# EasyEDA Pro project CapstoneMCU.epro

# Schematic Schematic1

## Sheets
1 sensors: Board Name: Board1; Create Date: 2026-01-15; Page Name: sensors; Project Name: CapPCB1; Schematic Name: Schematic1; Update Date: 2026-01-14; Page Size: A4; Version: V1.0
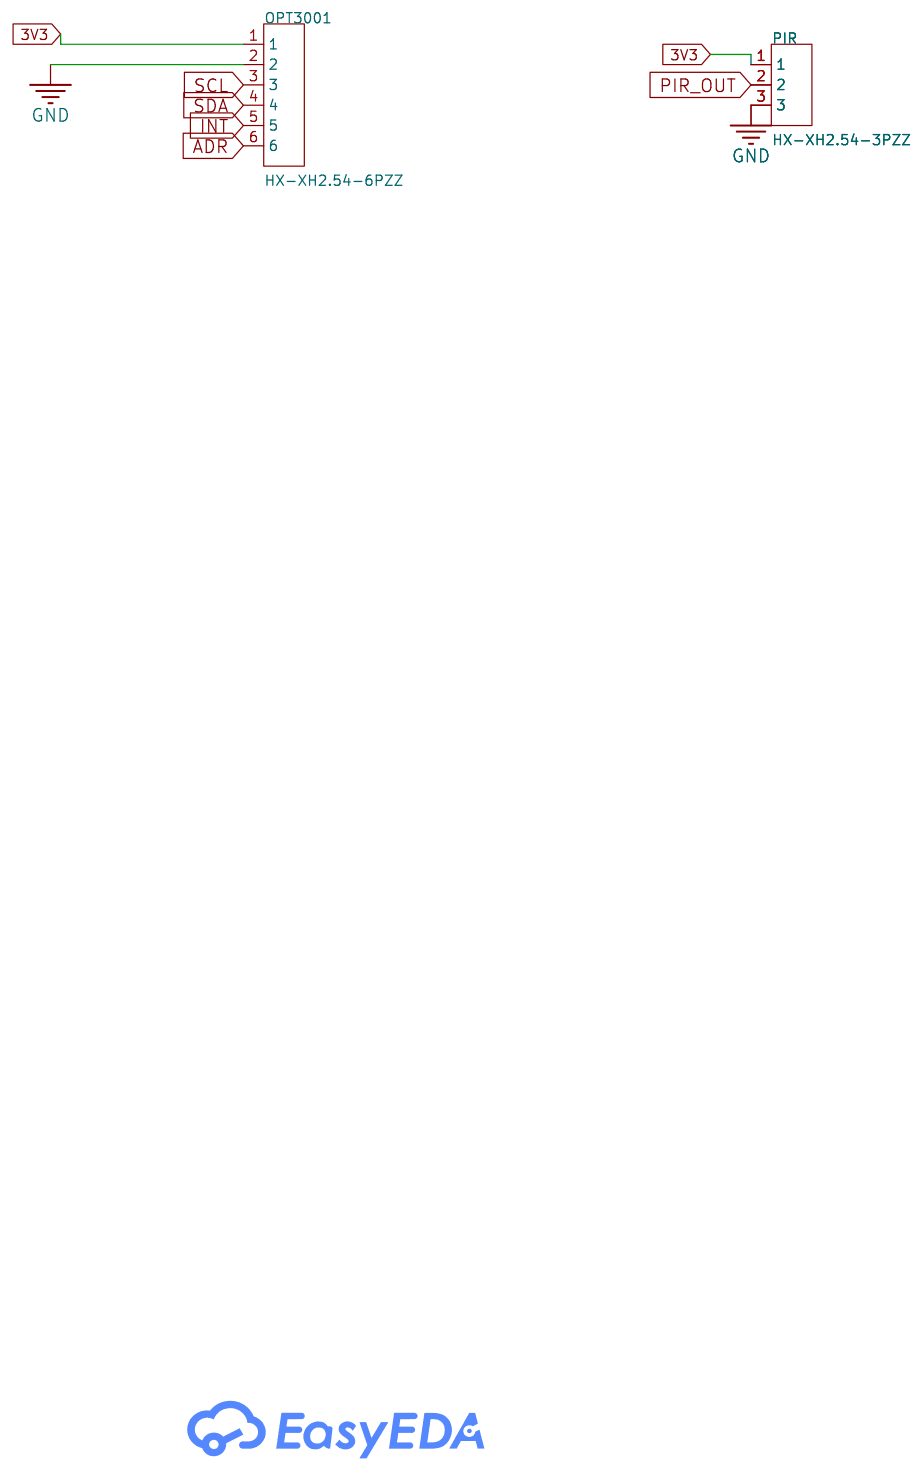
[diagram p0: sensors]
2 ESP32-S3: Page Name: ESP32-S3; Company: EasyEDA.com
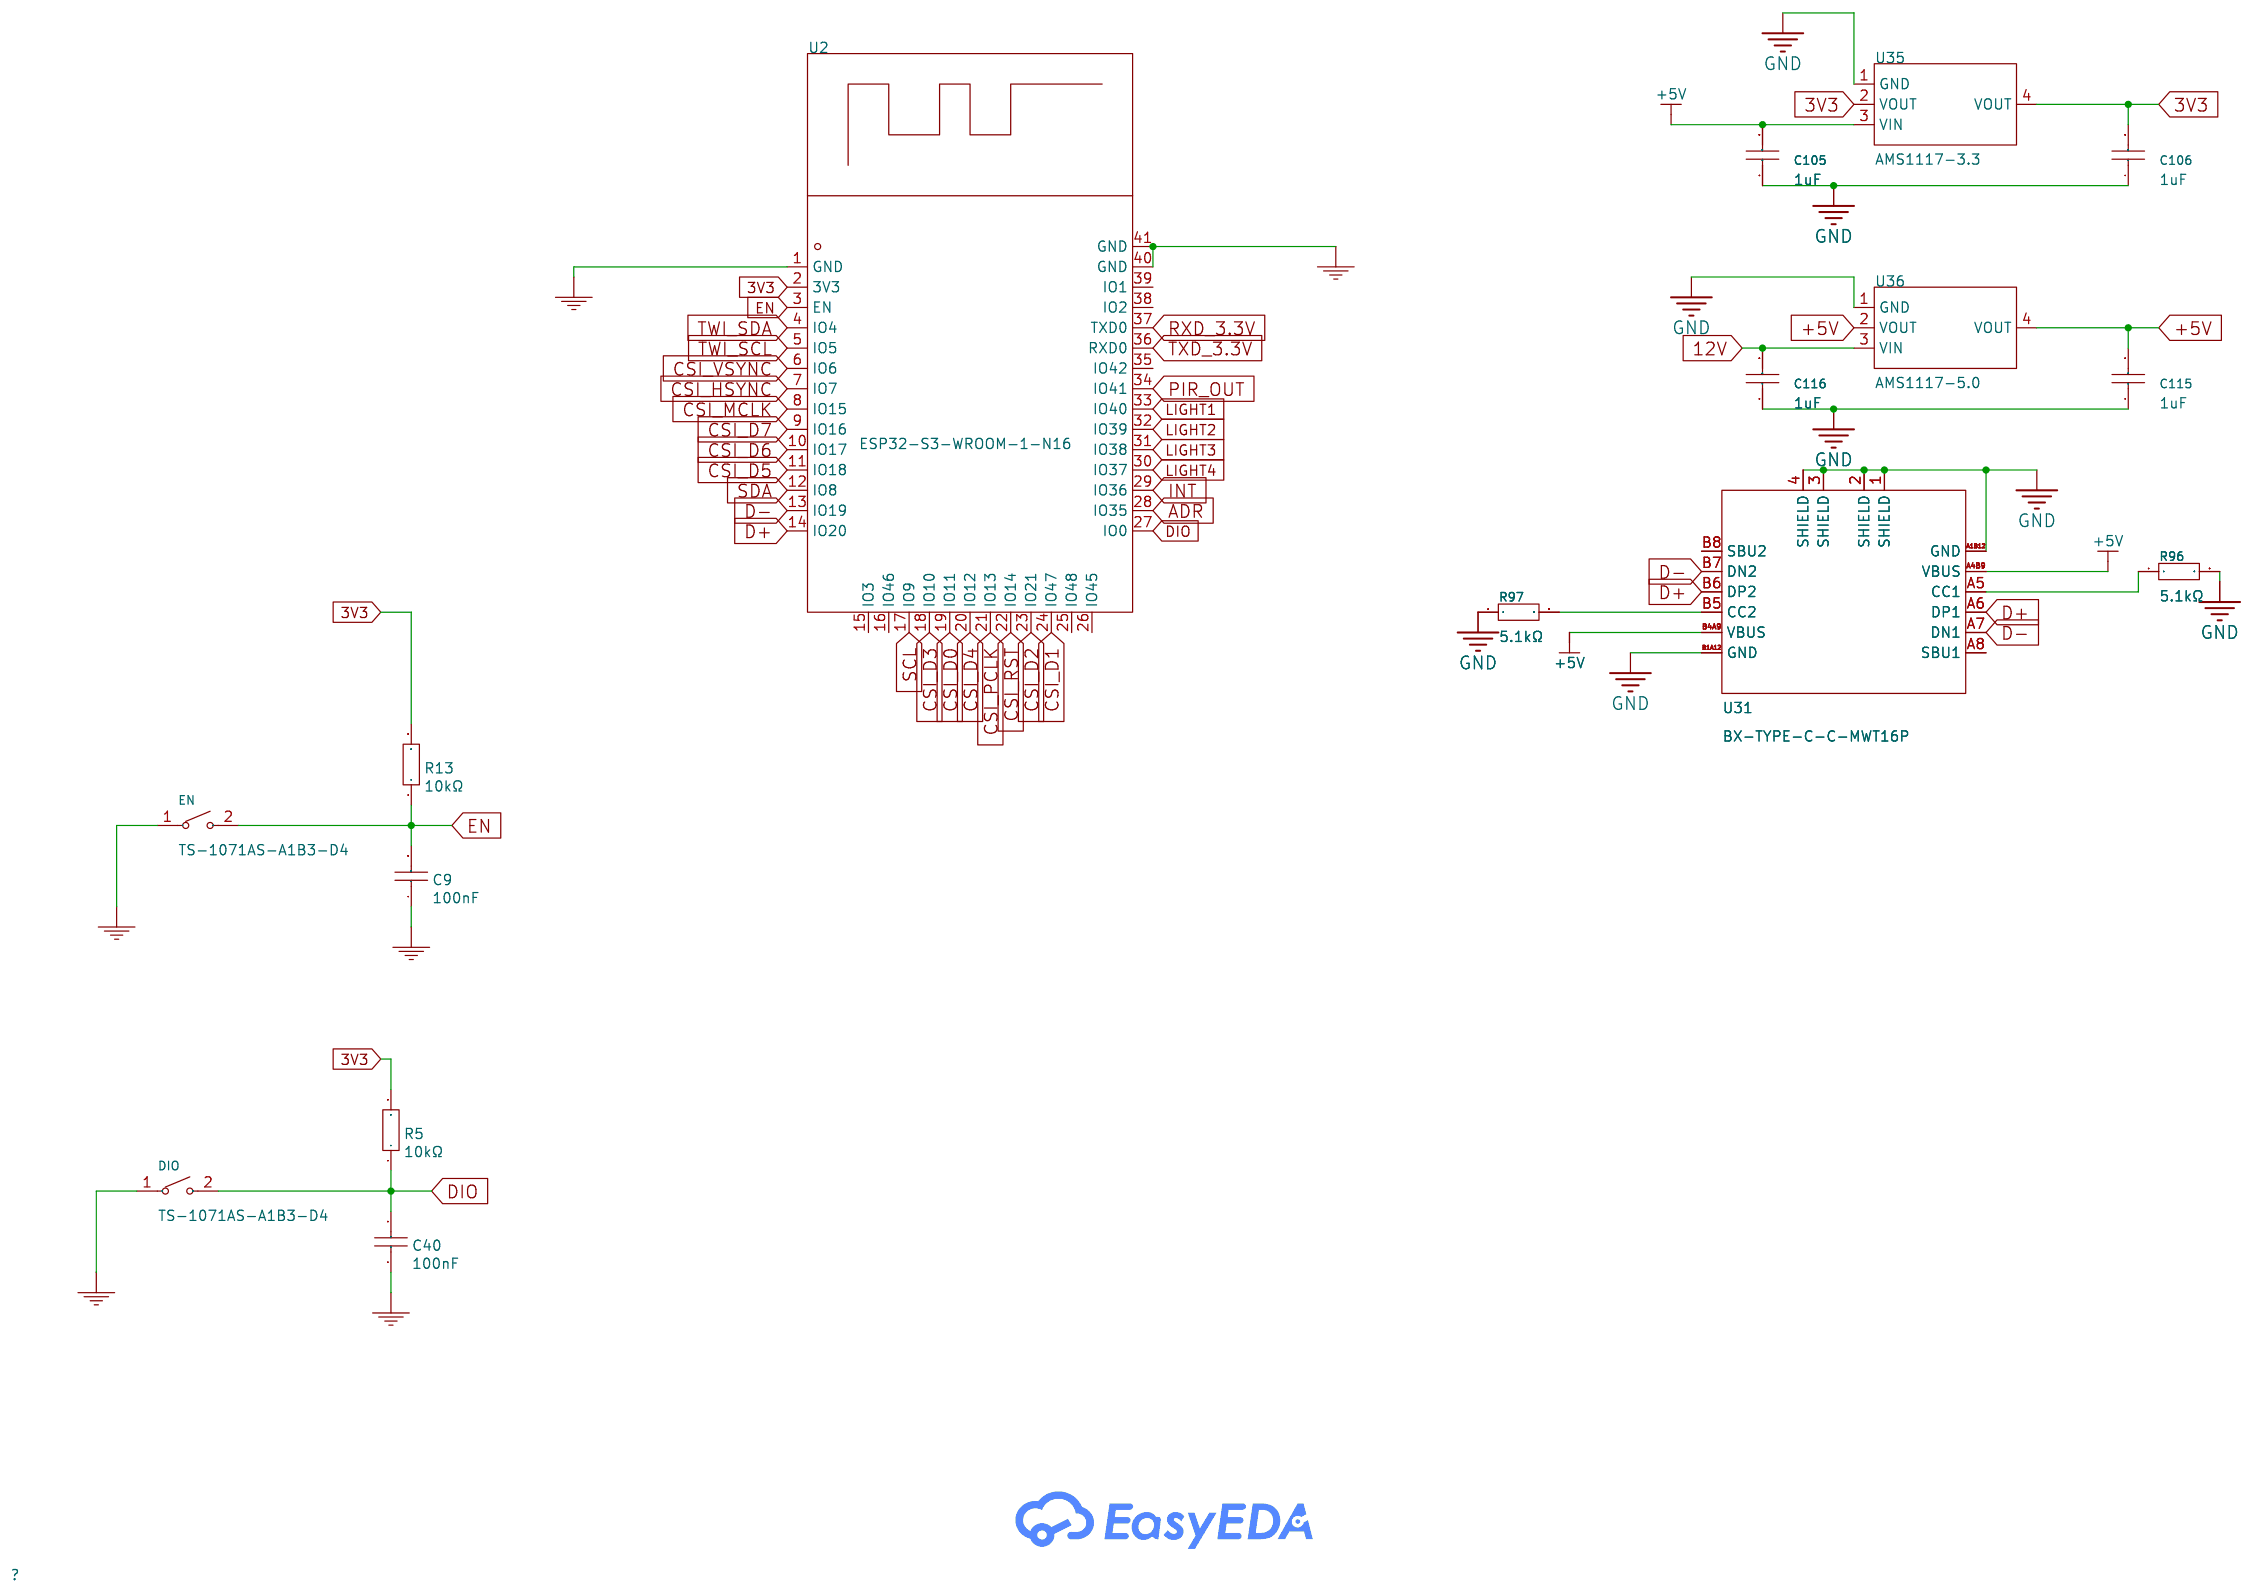
[diagram p1: ESP32-S3]
3 MOSFET: Create Date: 2026-01-14; Page Name: MOSFET; Update Date: 2026-02-08; Company: EasyEDA.com
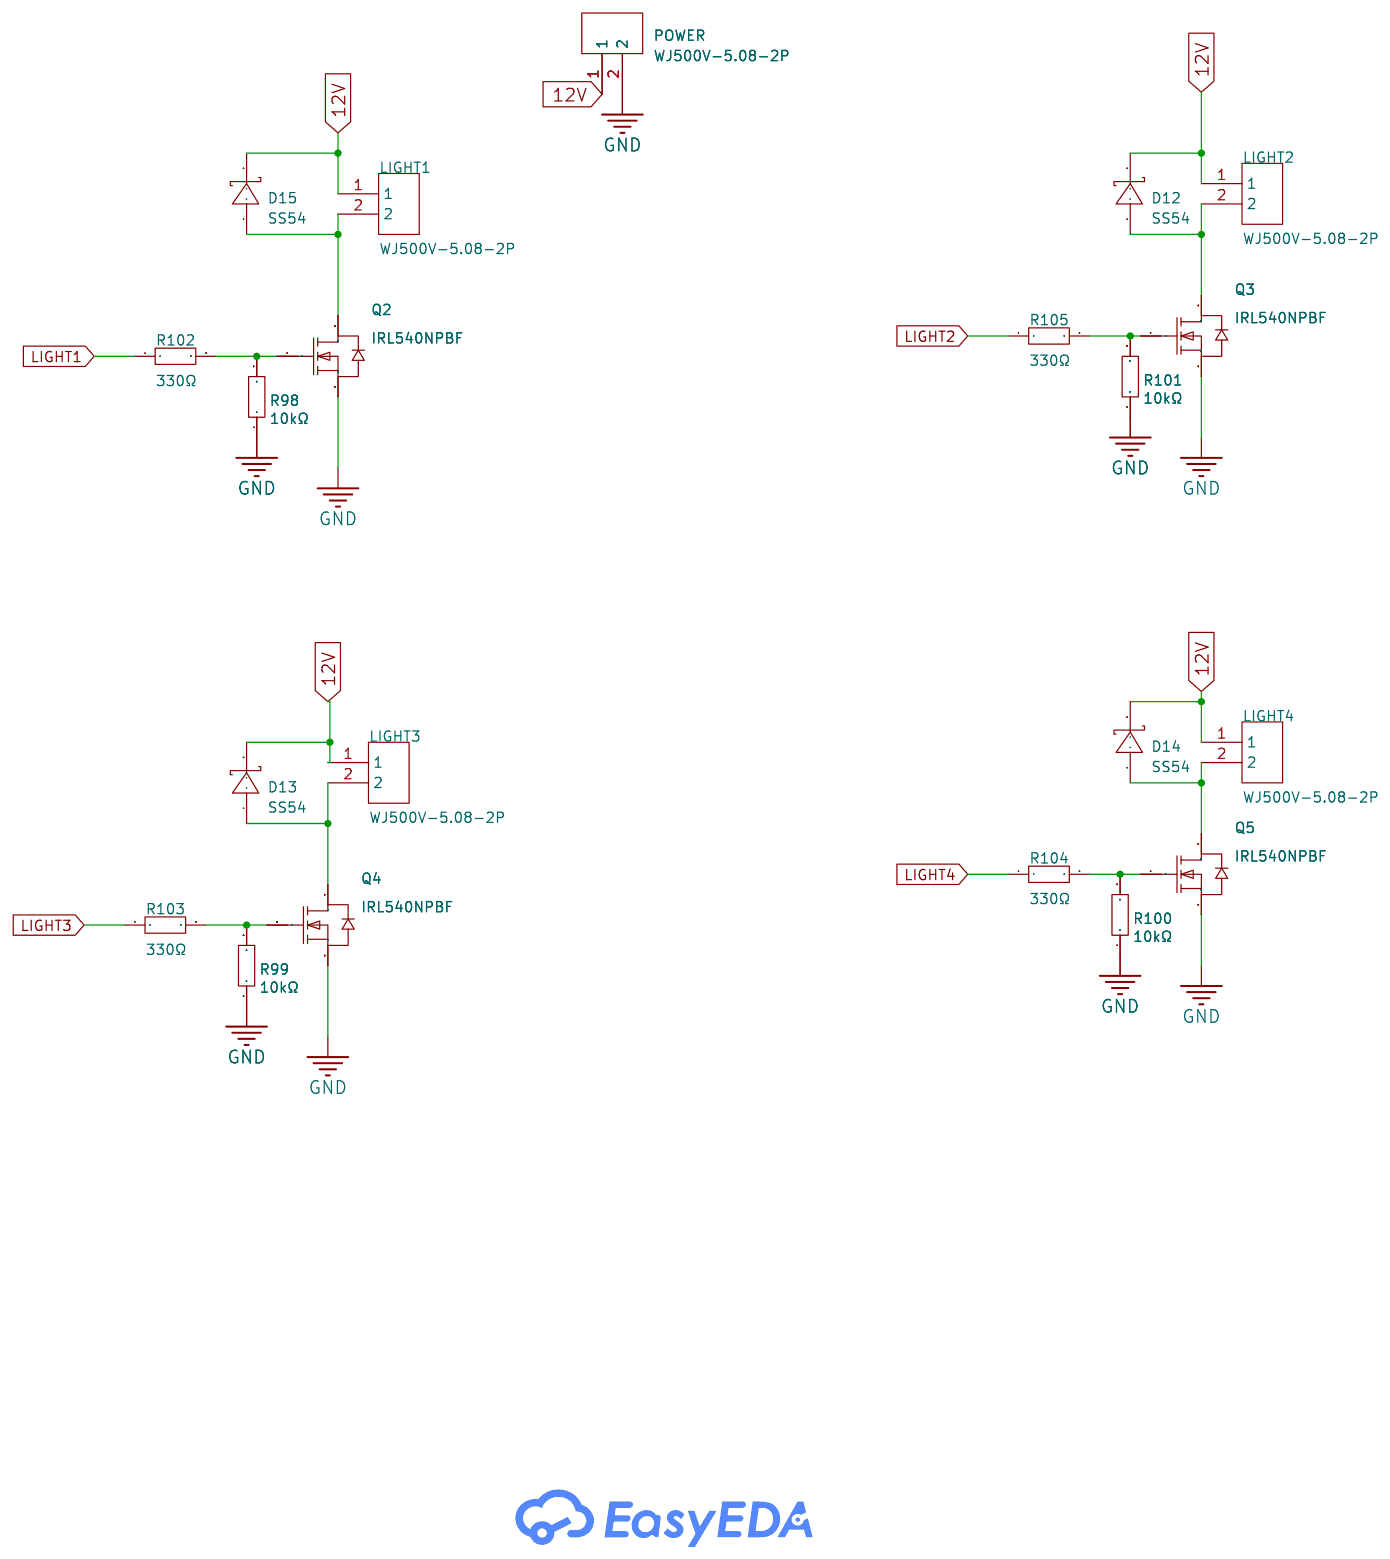
[diagram p2: MOSFET]
4 camera: Page Name: camera; Company: EasyEDA.com
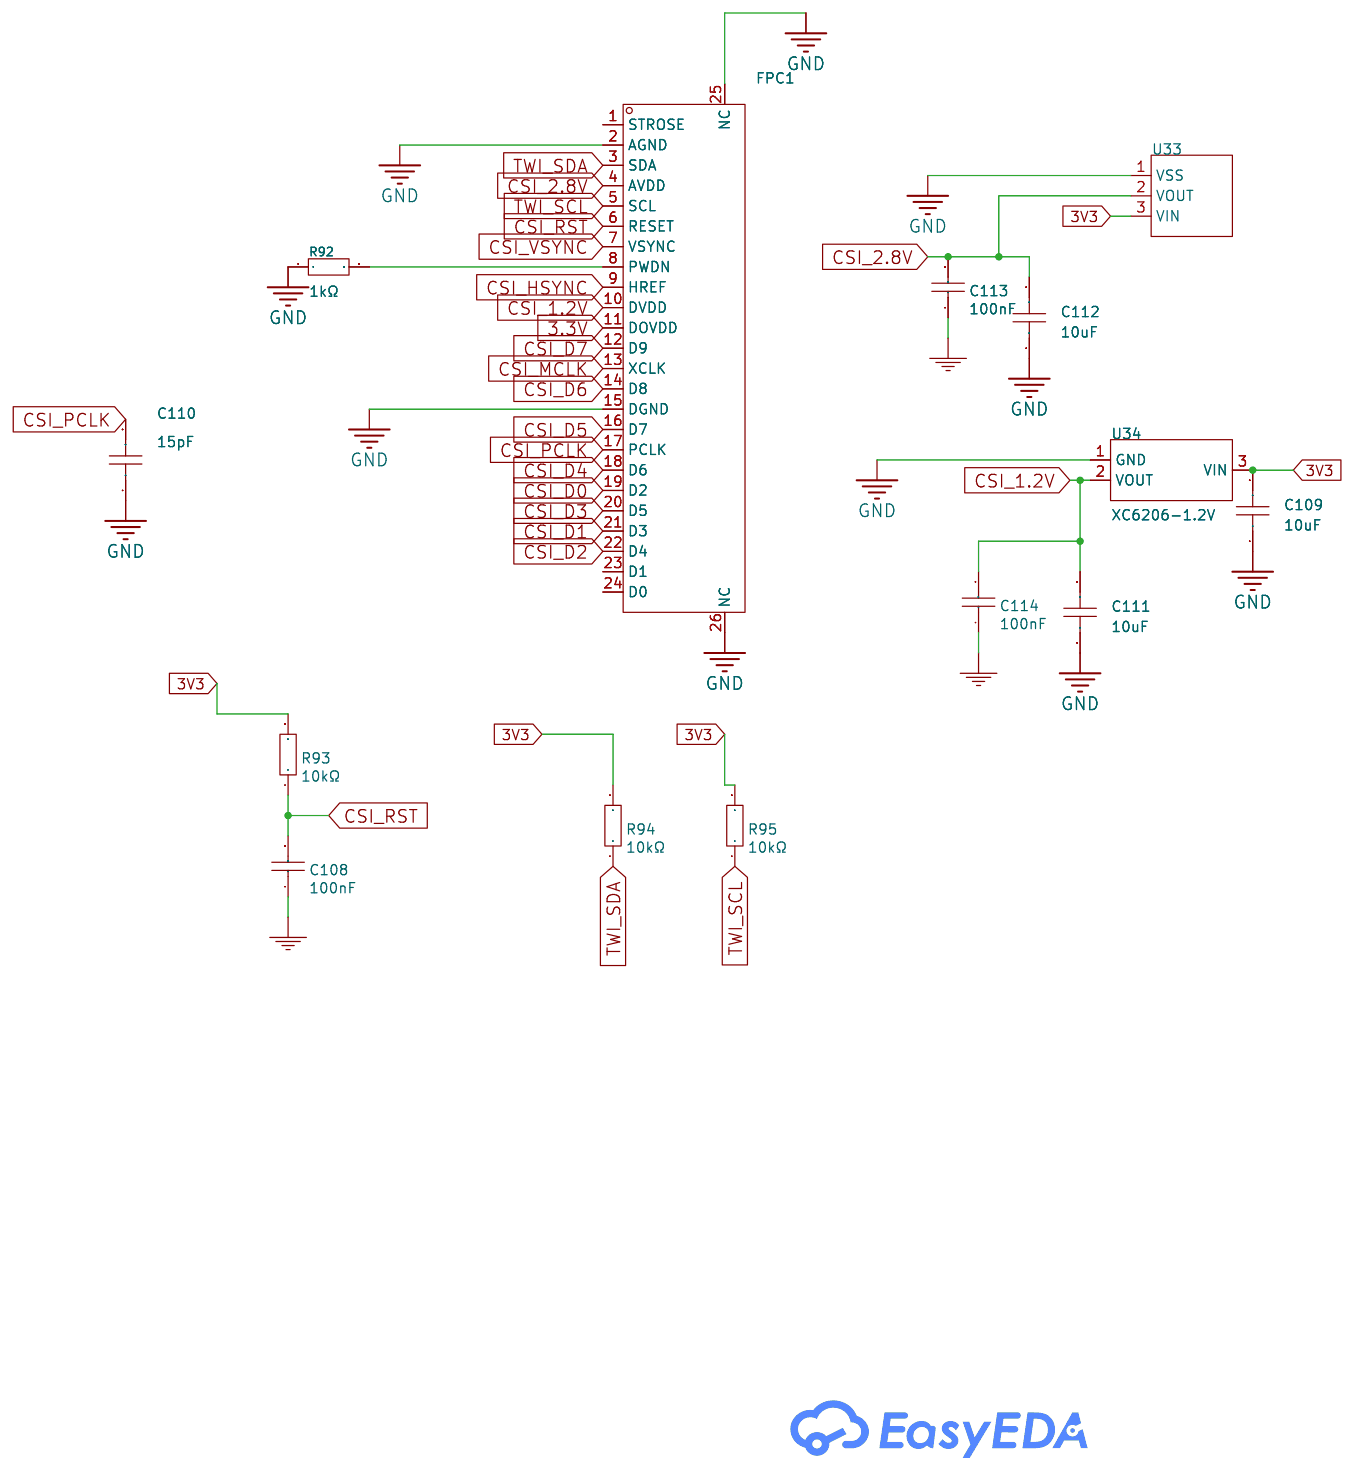
[diagram p3: camera]

## Parts
sheet camera
C108  100nF  [C0402_NEW]
C109  10uF  [C0402]
C110  15pF  [C0402]
C111  10uF  [C0402]
C112  10uF  [C0402]
C113  100nF  [C0402_NEW]
C114  100nF  [C0402_NEW]
FPC1  -  [FPC-SMD_P0.50-24P_XJ-FGS]
R92  1kΩ  [R0402]
R93  10kΩ  [R0402]
R94  10kΩ  [R0402]
R95  10kΩ  [R0402]
U33  XC6206-2.8V  [SOT-23-3_L2.9-W1.6-P1.90-LS2.8-BR]
U34  XC6206-1.2V  [SOT-23-3_L3.0-W1.6-P1.90-LS2.8-BR]
sheet ESP32-S3
C9  100nF  [C0402_NEW]
C40  100nF  [C0402_NEW]
C105  1uF  [C0402]
C106  1uF  [C0402]
C115  1uF  [C0402]
C116  1uF  [C0402]
DIO  TS-1071AS-A1B3-D4  [SW-SMD_L4.0-W3.0-LS4.8]
EN  TS-1071AS-A1B3-D4  [SW-SMD_L4.0-W3.0-LS4.8]
R5  10kΩ  [R0402]
R13  10kΩ  [R0402]
R96  5.1kΩ  [R0402]
R97  5.1kΩ  [R0402]
U2  ESP32-S3-WROOM-1-N16  [WIRELM-SMD_ESP32-S3-WROOM-1]
U31  BX-TYPE-C-C-MWT16P  [USB-C-SMD_BX-TYPE-C-C-MWT16P]
U35  AMS1117-3.3  [SOT-223-3_L6.5-W3.4-P2.30-LS7.0-BR]
U36  AMS1117-5.0  [SOT-223_L6.5-W3.5-P2.30-LS7.0-BR]
sheet MOSFET
D12  SS54  [SMA_L4.4-W2.8-LS5.4-R-RD]
D13  SS54  [SMA_L4.4-W2.8-LS5.4-R-RD]
D14  SS54  [SMA_L4.4-W2.8-LS5.4-R-RD]
D15  SS54  [SMA_L4.4-W2.8-LS5.4-R-RD]
LIGHT1  WJ500V-5.08-2P  [CONN-TH_2P-P5.00_WJ500V-5.08-2P]
LIGHT2  WJ500V-5.08-2P  [CONN-TH_2P-P5.00_WJ500V-5.08-2P]
LIGHT3  WJ500V-5.08-2P  [CONN-TH_2P-P5.00_WJ500V-5.08-2P]
LIGHT4  WJ500V-5.08-2P  [CONN-TH_2P-P5.00_WJ500V-5.08-2P]
POWER  WJ500V-5.08-2P  [CONN-TH_2P-P5.00_WJ500V-5.08-2P]
Q2  IRL540NPBF  [TO-220-3_L10.0-W4.5-P2.54-T]
Q3  IRL540NPBF  [TO-220-3_L10.0-W4.5-P2.54-T]
Q4  IRL540NPBF  [TO-220-3_L10.0-W4.5-P2.54-T]
Q5  IRL540NPBF  [TO-220-3_L10.0-W4.5-P2.54-T]
R98  10kΩ  [R0402]
R99  10kΩ  [R0402]
R100  10kΩ  [R0402]
R101  10kΩ  [R0402]
R102  330Ω  [R0402]
R103  330Ω  [R0402]
R104  330Ω  [R0402]
R105  330Ω  [R0402]
sheet sensors
OPT3001  HX-XH2.54-6PZZ  [CONN-TH_6P-P2.50_BX-XH2.54-6PZZ]
PIR  HX-XH2.54-3PZZ  [CONN-TH_3P-P2.50_HC-XH-3A-G]

## Library data of the parts
C9 C40 C108 C113 C114 = 100nF: Supplier: LCSC; Manufacturer Part: CL05B104KO5NNNC; Manufacturer: SAMSUNG; Supplier Part: C1525; JLCPCB Part Class: Basic Part
C109 C111 C112 = CL05A106MP5NUNC_C315248: Capacitance:10uF Tolerance:±20% Tolerance:±20% Voltage Rating:10V Temperature Coefficient:X5R; LCSC Part Name: 10uF ±20% 10V; Supplier Part: C315248; Manufacturer: SAMSUNG(三星); Manufacturer Part: CL05A106MP5NUNC; Supplier Footprint: 0402; JLCPCB Part Class: Extended Part; Datasheet: https://item.szlcsc.com/datasheet/CL05A106MP5NUNC/297154.html; Supplier: LCSC; Tolerance: ±20%; Voltage Rating: 10V; Temperature Coefficient: X5R
C110 = CL05C150JB5NNNC: Capacitance:15pF Tolerance:±5% Tolerance:±5% Voltage Rating:50V Temperature Coefficient:C0G; LCSC Part Name: 15pF ±5% 50V; Supplier Part: C86285; Manufacturer: SAMSUNG(三星); Supplier Footprint: 0402; Datasheet: https://item.szlcsc.com/datasheet/CL05C150JB5NNNC/87461.html; Supplier: LCSC; Tolerance: ±5%; Voltage Rating: 50V; Temperature Coefficient: C0G
FPC1 = OV2640: Pin Type: IN; Supplier Part: C132514
R92 = 0402WGF1001TCE: Type:Thick Film Resistors Resistance:1kΩ Tolerance:±1% Tolerance:±1% Power(Watts): Overload Voltage (Max): Temperature Coefficient:±100ppm/℃ Temperature Coefficient:±100ppm/℃ Operating Temperature Range:-55℃~+155℃ Operating Temperature Range:-55℃~+155℃; LCSC Part Name: 1kΩ ±1% 62.5mW 厚膜电阻; Supplier Part: C11702; Manufacturer: UNI-ROYAL(厚声); Supplier Footprint: 0402; JLCPCB Part Class: Basic Part; Datasheet: https://atta.szlcsc.com/upload/public/pdf/source/20200306/C422600_1E6D84923E4A46A82E41ADD87F860B5C.pdf; Supplier: LCSC; Type: Thick Film Resistors; Tolerance: ±1%; Temperature Coefficient: ±100ppm/℃; Operating Temperature Range: -55℃~+155℃
R5 R13 R93-R95 R98-R101 = 10kΩ: Supplier: LCSC; Manufacturer: UniOhm; Manufacturer Part: 0402WGF1002TCE; Supplier Part: C25744; Resistance: 10K; JLCPCB Part Class: Basic Part
U33 = XC6206-2.8V: Output Type:Fixed Voltage - Supply:6V Output Voltage:2.8V Output Voltage:2.8V Output Current:250mA Features:Short-Circuit  Protection(SCP)；Low ESR；Overcurrent Protection(OCP) Operating Temperature:-40℃~+85℃@(Tj) Operating Temperature:-40℃~+85℃@(Tj) Output; LCSC Part Name: 输入6V 输出2.8V 250mA; Supplier Part: C2892669; Manufacturer: YONGYUTAI(永裕泰); Supplier Footprint: SOT-23-3L; JLCPCB Part Class: Extended Part; Datasheet: https://atta.szlcsc.com/upload/public/pdf/source/20210901/DE3C77F0CE73FFE8F7C655BE9B94CB06.pdf; Supplier: LCSC; Output Type: Fixed; Voltage - Supply: 6V; Output Voltage: 2.8V; Output Current: 250mA; Features: Short-Circuit  Protection(SCP)；Low ESR；Overcurrent Protection(OCP); Operating Temperature: -40℃~+85℃@(Tj); Output Configuration: Positive electrode; Number of Outputs: 1
U34 = XC6206-1.2V_C49446790: Supplier Part: C49446790; Manufacturer: YONGYUTAI(永裕泰); Supplier Footprint: SOT-23-3; JLCPCB Part Class: Extended Part; Datasheet: https://item.szlcsc.com/datasheet/XC6206-1.2V/51987195.html; Supplier: LCSC
C105 C106 C115 C116 = CL05A105KP5NNNC: Capacitance: Tolerance:±10% Tolerance:±10% Voltage Rated: Temperature Coefficient:; LCSC Part Name: 1uF ±10% 10V; Supplier Part: C14445; Manufacturer: SAMSUNG(三星); Supplier Footprint: 0402; JLCPCB Part Class: Extended Part; Datasheet: https://atta.szlcsc.com/upload/public/pdf/source/20160218/1457707763339.pdf; Supplier: LCSC; Tolerance: ±10%
DIO EN = TS-1071AS-A1B3-D4: Circuit:SPST Actuator Style:Round Button Operating Force:250gf Mounting Style:Brick nogging Switch Length:4mm Switch Width:3mm Switch Height:2mm Actuator/Cap Color:Blue Pin Style:SMDSplicing Mechanical Life:-; LCSC Part Name: 4*3*2mm 立贴 轻触开关; Supplier Part: C492861; Manufacturer: Yuandi(元迪); Supplier Footprint: SMD; JLCPCB Part Class: Extended Part; Datasheet: https://atta.szlcsc.com/upload/public/pdf/source/20200427/C492861_8410BFD0129EF5D536AF148AD1D8A09B.pdf; Supplier: LCSC; Circuit: SPST; Actuator Style: Round Button; Operating Force: 250gf; Mounting Style: Brick nogging; Switch Length: 4mm; Switch Width: 3mm; Switch Height: 2mm; Actuator/Cap Color: Blue; Pin Style: SMDSplicing
R96 R97 = 0402WGF5101TCE: Type:Thick Film Resistor Resistance:5.1kΩ Tolerance:±1% Tolerance:±1% Power(Watts):62.5mW Voltage-Supply(Max):50V Temperature Coefficient:±100ppm/℃ Temperature Coefficient:±100ppm/℃ Operating Temperature:-55℃~+155℃ Operating Temperature:-55℃~+155℃; LCSC Part Name: 5.1kΩ ±1% 62.5mW 厚膜电阻; Supplier Part: C25905; Manufacturer: UNI-ROYAL(厚声); Supplier Footprint: 0402; Datasheet: https://item.szlcsc.com/datasheet/0402WGF5101TCE/26648.html; Supplier: LCSC; Type: Thick Film Resistor; Tolerance: ±1%; Power(Watts): 62.5mW; Voltage-Supply(Max): 50V; Temperature Coefficient: ±100ppm/℃; Operating Temperature: -55℃~+155℃
U2 = ESP32-S3-WROOM-1-N16: LCSC Part Name: 通用型Wi-Fi+低功耗蓝牙MCU模组; Supplier Part: C2913199; Manufacturer: ESPRESSIF(乐鑫); Supplier Footprint: SMD,18x25.5mm; JLCPCB Part Class: Extended Part; Datasheet: https://atta.szlcsc.com/upload/public/pdf/source/20241030/6A412B13087E1327DF6279F5735253CA.pdf; Supplier: LCSC
U31 = BX-TYPE-C-C-MWT16P: Connector Type:Type-C Standard:USB 3.1 Gender:Mother Mounting Style:Horizontal attachment Number of Contacts:16P Number of Ports:1 Current Rating - Power (Max):5A Operating Temperature Range:-45℃~+85℃ Operating Temperature Range:-45℃~+85℃; LCSC Part Name: Type-C 母 卧贴; Supplier Part: C18077665; Manufacturer: Bossie(博锡); Supplier Footprint: SMD; JLCPCB Part Class: Extended Part; Datasheet: https://atta.szlcsc.com/upload/public/pdf/source/20231017/F39B3F898DD8D16D3D2CEE0BEEB24AE0.pdf; Supplier: LCSC; Connector Type: Type-C; Standard: USB 3.1; Gender: Mother; Mounting Style: Horizontal attachment; Number of Contacts: 16P; Number of Ports: 1; Current Rating - Power (Max): 5A; Operating Temperature Range: -45℃~+85℃
U35 = AMS1117-3.3_C6186: Output Type:Fixed Voltage - Supply:16V Output Voltage:3.3V Output Voltage:3.3V Output Current:1A Power Supply Rejection Ratio (PSRR):72dB@(120Hz) Voltage Dropout:1.1V@(800mA) standby current:5mA Noise:0.003%Vout Features:Over Current Protection；Over Tempe; LCSC Part Name: 输出3.3V 1A; Supplier Part: C6186; Manufacturer: AMS; Supplier Footprint: SOT-223; JLCPCB Part Class: Basic Part; Datasheet: https://item.szlcsc.com/datasheet/AMS1117-3.3/6652.html; Supplier: LCSC; Output Type: Fixed; Voltage - Supply: 16V; Output Voltage: 3.3V; Output Current: 1A; Power Supply Rejection Ratio (PSRR): 72dB@(120Hz); Voltage Dropout: 1.1V@(800mA); standby current: 5mA; Noise: 0.003%Vout; Features: Over Current Protection；Over Temperature Protection; Operating Temperature: -40℃~+125℃; Output Configuration: Positive; Number of Outputs: 1
U36 = AMS1117-5.0_C6187: Output Type:Fixed Voltage - Supply:15V Output Voltage:5V Output Voltage:5V Output Current:1A Power Supply Rejection Ratio (PSRR):60dB Voltage Dropout:1.3V standby current:- Noise:- Features:- Operating Temperature:-40℃~+125℃ Operating Temperature:-40℃~+12; LCSC Part Name: 输入15V 输出5V 1A; Supplier Part: C6187; Manufacturer: AMS; Supplier Footprint: SOT-223; Datasheet: https://item.szlcsc.com/datasheet/AMS1117-5.0/6653.html; Supplier: LCSC; Output Type: Fixed; Voltage - Supply: 15V; Output Voltage: 5V; Output Current: 1A; Power Supply Rejection Ratio (PSRR): 60dB; Voltage Dropout: 1.3V; Operating Temperature: -40℃~+125℃; Output Configuration: Positive; Number of Outputs: 1
D12-D15 = SS54_C22452: Diode Configuration:Independent Voltage - Forward(Vf@If):550mV@5A Voltage - DC Reverse(Vr):40V Current - Rectified:5A Reverse Leakage Current (Ir):1mA@40V Operating Junction Temperature Range:-55℃~+125℃ Operating Junction Temperature Range:-55℃~+125℃; LCSC Part Name: 电压:40V 电流:5A; Supplier Part: C22452; Manufacturer: MDD(辰达半导体); Supplier Footprint: SMA(DO-214AC); JLCPCB Part Class: Basic Part; Datasheet: https://item.szlcsc.com/datasheet/SS54/23178.html; Supplier: LCSC; Diode Configuration: Independent; Voltage - Forward(Vf@If): 550mV@5A; Voltage - DC Reverse(Vr): 40V; Current - Rectified: 5A; Reverse Leakage Current (Ir): 1mA@40V; Operating Junction Temperature Range: -55℃~+125℃
LIGHT1-LIGHT4 POWER = WJ500V-5.08-2P: Structure:1x2P Pitch:5.08mm Color:Green Mounting Style:Direct Insert Current Rating (Max):18A Voltage Rating (Max):250V Number of Pins:2P Number of Rows:1 Wire Gauge - AWG:14~30 Wire Gauge - AWG:14~30 Wire Gauge - mm2:2.5 Wire Gauge - mm2:2.5 Number of PI; LCSC Part Name: 1x2P 5.08mm 直插 排数:1 每排P数:2; Supplier Part: C8465; Manufacturer: KANGNEX(康奈克斯电气); Supplier Footprint: 插件,P=5.08mm; JLCPCB Part Class: Extended Part; Datasheet: https://atta.szlcsc.com/upload/public/pdf/source/20191225/C8465_02D34CE5B5B4A53DF5891601D97FA9F4.pdf; Supplier: LCSC; Structure: 1x2P; Pitch: 5.08mm; Color: Green; Mounting Style: Direct Insert; Current Rating (Max): 18A; Voltage Rating (Max): 250V; Number of Pins: 2P; Number of Rows: 1; Wire Gauge - AWG: 14~30; Wire Gauge - mm2: 2.5; Number of PINs Per Row: 2; Operating Temperature Range: -40℃~+105℃; Screw Specification: M2.5
Q2-Q5 = IRL540NPBF: Type:1 N-Channel Drain Source Voltage (Vdss): Continuous Drain Current (Id): Drain Source On Resistance (RDS(on)@Vgs,Id):0.044Ω@10V,18A Power Dissipation (Pd): Gate Threshold Voltage (Vgs(th)@Id):1V@250uA Total Gate Charge (Qg@Vgs):74nC Input Capacitance; LCSC Part Name: 1个N沟道 耐压:100V 电流:36A; Supplier Part: C111607; Manufacturer: Infineon(英飞凌); Supplier Footprint: TO-220AB; JLCPCB Part Class: Extended Part; Datasheet: https://atta.szlcsc.com/upload/public/pdf/source/20170925/C111607_1506321340480990091.pdf; Supplier: LCSC; Type: 1 N-Channel; Drain Source On Resistance (RDS(on)@Vgs,Id): 0.044Ω@10V,18A; Gate Threshold Voltage (Vgs(th)@Id): 1V@250uA; Total Gate Charge (Qg@Vgs): 74nC; Input Capacitance (Ciss@Vds): 1.8nF; Reverse Transfer Capacitance (Crss@Vds): 170pF; Operating Temperature: -55℃~+175℃
R102-R105 = RC0402FR-07330RL: Type:Thick Film Resistor Resistance:330Ω Tolerance:±1% Tolerance:±1% Power(Watts):62.5mW Voltage-Supply(Max):50V Temperature Coefficient:±100ppm/℃ Temperature Coefficient:±100ppm/℃ Operating Temperature:-55℃~+155℃ Operating Temperature:-55℃~+155℃; LCSC Part Name: 厚膜电阻 330Ω ±1% 62.5mW; Supplier Part: C105875; Manufacturer: YAGEO(国巨); Supplier Footprint: 0402; Datasheet: https://item.szlcsc.com/datasheet/RC0402FR-07330RL/107090.html; Supplier: LCSC; Type: Thick Film Resistor; Tolerance: ±1%; Power(Watts): 62.5mW; Voltage-Supply(Max): 50V; Temperature Coefficient: ±100ppm/℃; Operating Temperature: -55℃~+155℃
OPT3001 = HX-XH2.54-6PZZ: Pins Structure:1x6P Pitch:2.54mm Mounting Type:Through Hole Reference Series:XH Number of Pins:6P Number of Rows:1 Number of PINs Per Row:6 Row Spacing:- Current Rating:3A Contact Material:Brass Contact Plating:Tin Operating Temperature:-25℃~+85℃ Operatin; LCSC Part Name: 1x6P 间距:2.54mm 直插 系列:XH; Supplier Part: C42391664; Manufacturer: hanxia(韩下); Supplier Footprint: 插件,P=2.5mm; Datasheet: https://item.szlcsc.com/datasheet/HX-XH2.54-6PZZ/44326936.html; Supplier: LCSC; Pins Structure: 1x6P; Pitch: 2.54mm; Mounting Type: Through Hole; Reference Series: XH; Number of Pins: 6P; Number of Rows: 1; Number of PINs Per Row: 6; Current Rating: 3A; Contact Material: Brass; Contact Plating: Tin; Operating Temperature: -25℃~+85℃; Voltage Rating: 250V; Plastic Material: PA66; Flame Retardant Rating: UL94V-0; Color: White
PIR = HX-XH2.54-3PZZ: Pins Structure:1x3P Pitch:2.54mm Mounting Type:Through Hole Reference Series:XH Number of Pins:3P Number of Rows:1 Number of PINs Per Row:3 Row Spacing:- Current Rating:3A Contact Material:Brass Contact Plating:Tin Operating Temperature:-25℃~+85℃ Operatin; LCSC Part Name: 1x3P 间距:2.54mm 直插 系列:XH; Supplier Part: C42391661; Manufacturer: hanxia(韩下); Supplier Footprint: 插件,P=2.5mm; Datasheet: https://item.szlcsc.com/datasheet/HX-XH2.54-3PZZ/44326933.html; Supplier: LCSC; Pins Structure: 1x3P; Pitch: 2.54mm; Mounting Type: Through Hole; Reference Series: XH; Number of Pins: 3P; Number of Rows: 1; Number of PINs Per Row: 3; Current Rating: 3A; Contact Material: Brass; Contact Plating: Tin; Operating Temperature: -25℃~+85℃; Voltage Rating: 250V; Plastic Material: PA66; Flame Retardant Rating: UL94V-0; Color: White

## Nets
3.3V: FPC1.11(DOVDD)
3V3: C106.2 C109.2 OPT3001.1 PIR.1 R5.2 R13.2 R93.2 R94.2 R95.2 U2.2(3V3) U33.3(VIN) U34.3(VIN) U35.2(VOUT) U35.4(VOUT)
12V: C116.2 D12.2(K) D13.2(K) D14.2(K) D15.2(K) LIGHT1.1 LIGHT2.1 LIGHT3.1 LIGHT4.1 POWER.1 U36.3(VIN)
+5V: C105.2 C115.2 U31.A4B9(VBUS) U31.B4A9(VBUS) U35.3(VIN) U36.2(VOUT) U36.4(VOUT)
GND: C9.1 C40.1 C105.1 C106.1 C108.1 C109.1 C110.1 C111.1 C112.1 C113.1 C114.1 C115.1 C116.1 DIO.1 EN.1 FPC1.2(AGND) FPC1.15(DGND) FPC1.25(NC) FPC1.26(NC) OPT3001.2 PIR.3 POWER.2 Q2.3(S) Q3.3(S) Q4.3(S) Q5.3(S) R92.1 R96.2 R97.1 R98.1 R99.1 R100.1 R101.1 U2.1(GND) U2.40(GND) U2.41(GND) U31.1(SHIELD) U31.2(SHIELD) U31.3(SHIELD) U31.4(SHIELD) U31.A1B12(GND) U31.B1A12(GND) U33.1(VSS) U34.1(GND) U35.1(GND) U36.1(GND)
ADR: OPT3001.6 U2.28(IO35)
CSI_1.2V: C111.2 C114.2 FPC1.10(DVDD) U34.2(VOUT)
CSI_2.8V: C112.2 C113.2 FPC1.4(AVDD) U33.2(VOUT)
CSI_D0: FPC1.19(D2) U2.19(IO11)
CSI_D1: FPC1.21(D3) U2.24(IO47)
CSI_D2: FPC1.22(D4) U2.23(IO21)
CSI_D3: FPC1.20(D5) U2.18(IO10)
CSI_D4: FPC1.18(D6) U2.20(IO12)
CSI_D5: FPC1.16(D7) U2.11(IO18)
CSI_D6: FPC1.14(D8) U2.10(IO17)
CSI_D7: FPC1.12(D9) U2.9(IO16)
CSI_HSYNC: FPC1.9(HREF) U2.7(IO7)
CSI_MCLK: FPC1.13(XCLK) U2.8(IO15)
CSI_PCLK: C110.2 FPC1.17(PCLK) U2.21(IO13)
CSI_RST: C108.2 FPC1.6(RESET) R93.1 U2.22(IO14)
CSI_VSYNC: FPC1.7(VSYNC) U2.6(IO6)
D+: U2.14(IO20) U31.A6(DP1) U31.B6(DP2)
D-: U2.13(IO19) U31.A7(DN1) U31.B7(DN2)
DIO: C40.2 DIO.2 R5.1 U2.27(IO0)
EN: C9.2 EN.2 R13.1 U2.3(EN)
INT: OPT3001.5 U2.29(IO36)
LIGHT1: R102.1 U2.33(IO40)
LIGHT2: R105.1 U2.32(IO39)
LIGHT3: R103.1 U2.31(IO38)
LIGHT4: R104.1 U2.30(IO37)
PIR_OUT: PIR.2 U2.34(IO41)
RXD_3.3V: U2.37(TXD0)
SCL: OPT3001.3 U2.17(IO9)
SDA: OPT3001.4 U2.12(IO8)
TWI_SCL: FPC1.5(SCL) R95.1 U2.5(IO5)
TWI_SDA: FPC1.3(SDA) R94.1 U2.4(IO4)
TXD_3.3V: U2.36(RXD0)
$2N5410: R96.1 U31.A5(CC1)
$2N5414: R97.2 U31.B5(CC2)
$3N380: D15.1(A) LIGHT1.2 Q2.2(D)
$3N383: Q2.1(G) R98.2 R102.2
$3N715: Q3.1(G) R101.2 R105.2
$3N716: D12.1(A) LIGHT2.2 Q3.2(D)
$3N1364: Q4.1(G) R99.2 R103.2
$3N1375: D13.1(A) LIGHT3.2 Q4.2(D)
$3N1376: Q5.1(G) R100.2 R104.2
$3N1377: D14.1(A) LIGHT4.2 Q5.2(D)
$4N651: FPC1.8(PWDN) R92.2

Not connected (* = marked no-connect by the designer): FPC1 1(STROSE) 23(D1) 24(D0); U2 15(IO3) 16(IO46) 25(IO48) 26(IO45) 35(IO42) 38(IO2) 39(IO1); U31 A8(SBU1) B8(SBU2)

# Board PCB1
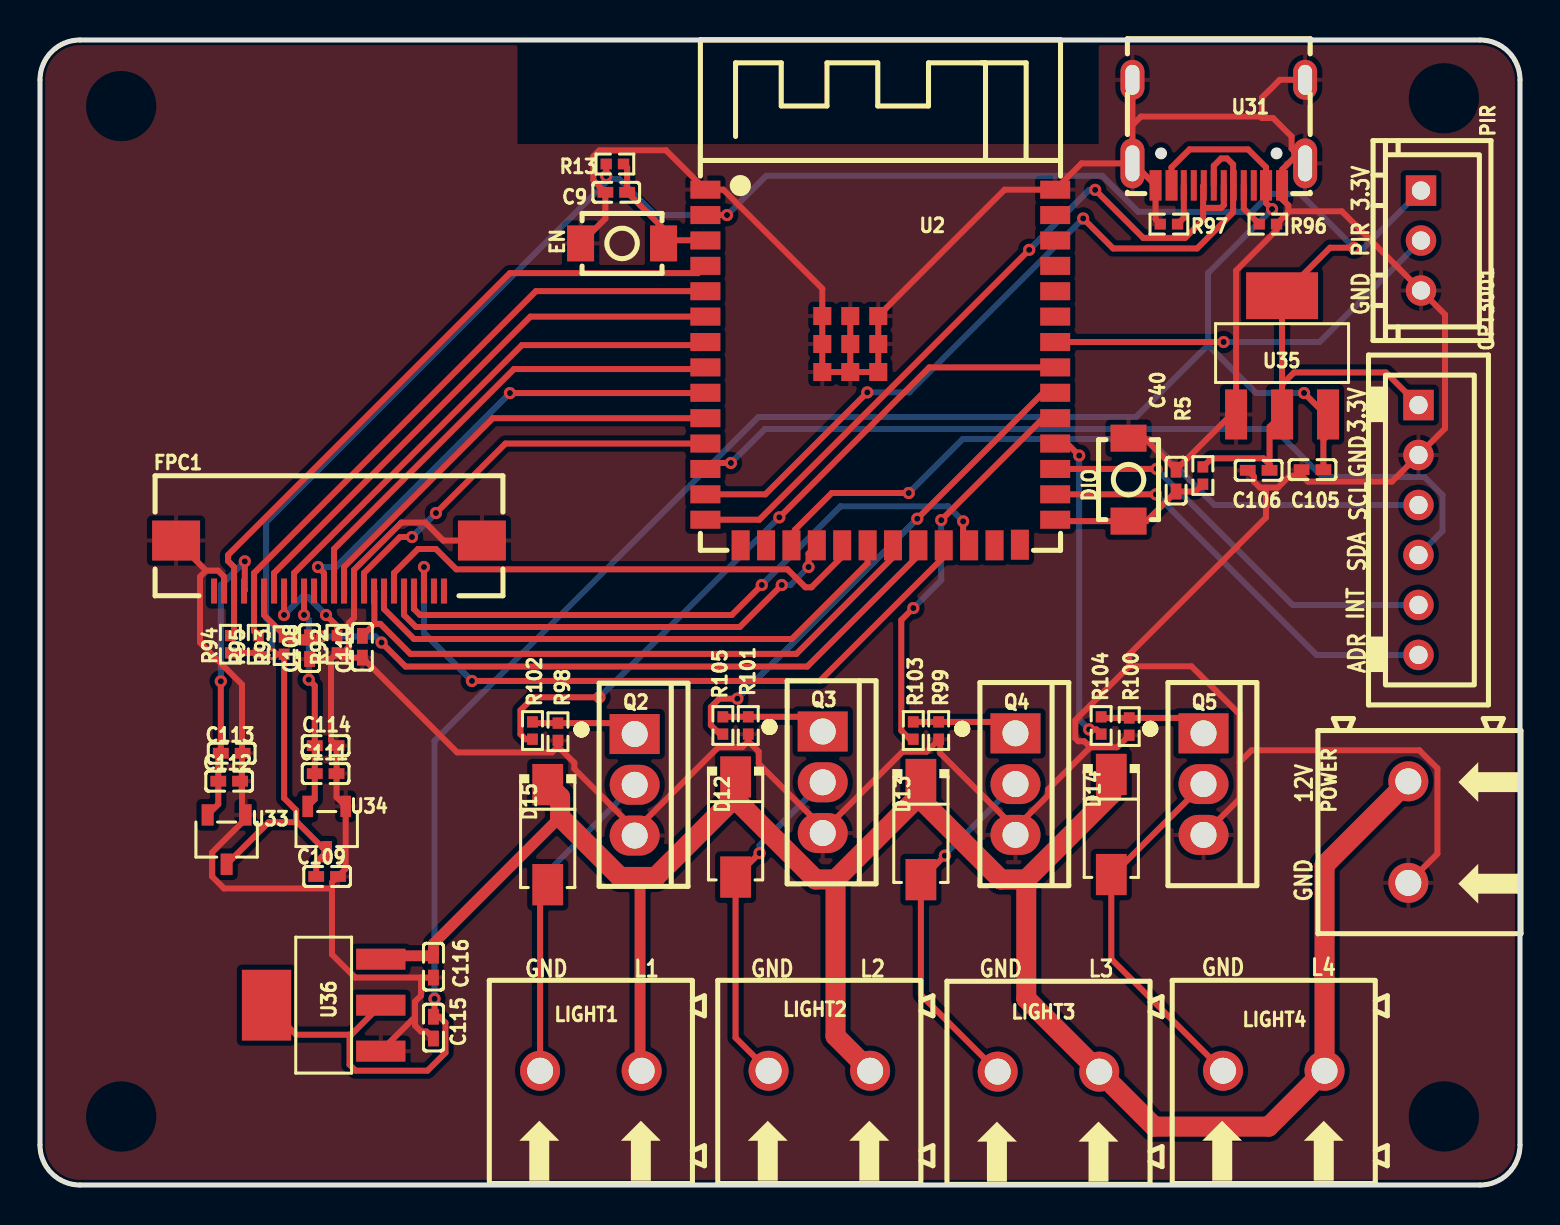
[diagram p4: board, top side]
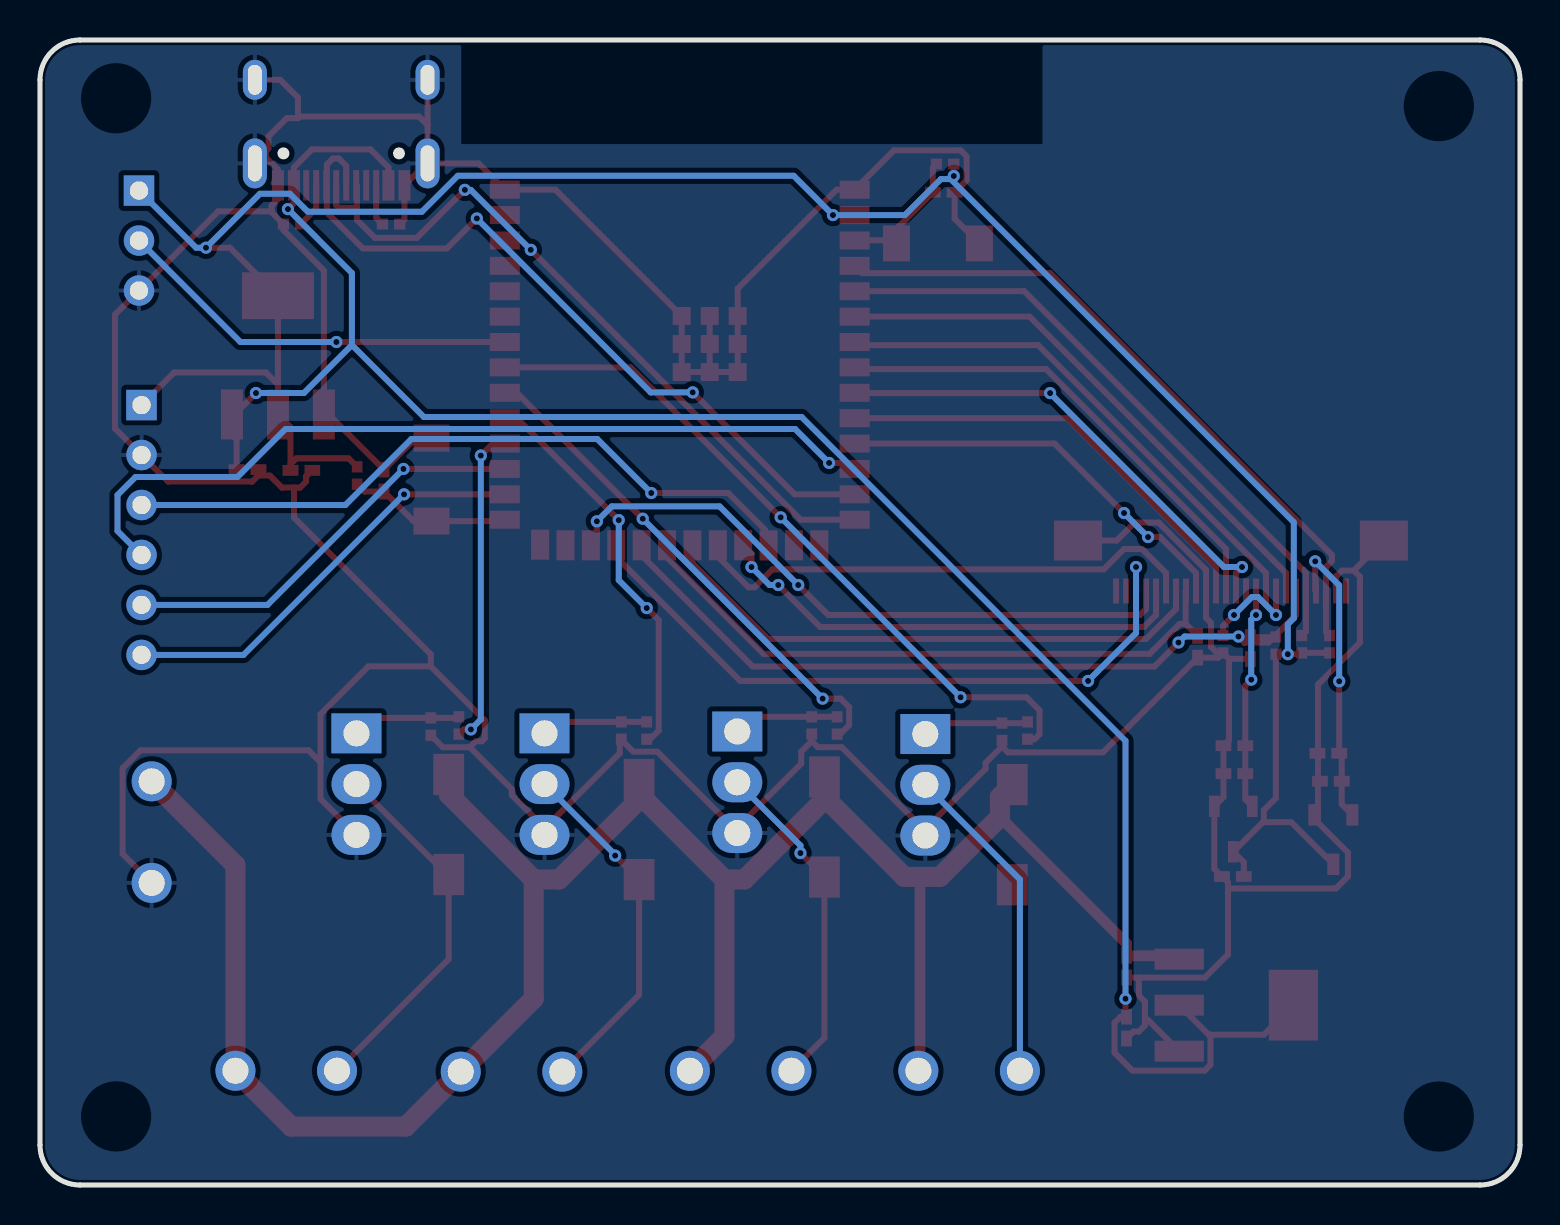
[diagram p5: board, bottom side, seen from below]

Outline 74.04 x 57.28 mm; copper layers: Top Layer, Bottom Layer. Coordinates in mm from the lower left corner of the outline.
Outline path: 0,55.28 0,2 arc(0.59,0.59) 2,0 72.04,0 arc(73.46,0.59) 74.04,2 74.04,55.28 arc(73.46,56.69) 72.04,57.28 2,57.28 arc(0.59,56.69) 0,55.28
Stack: Top Layer 0.035mm / Dielectric1 1.51mm FR4 er 4.5 / Bottom Layer 0.035mm

## Design rules (mm)
template: Custom Config
spacing copperThickness1oz (default): track to track 0.102, other pairs 0.152 to 0.3
spacing copperThickness2oz: track to track 0.203, other pairs 0.152 to 0.3
track width copperThickness1oz (default): min 0.25, default 0.3, max 2.54
track width copperThickness2oz: min 0.5, default 1, max 2.54
differential pair differentialPair (default): width min 0.127, default 0.254, max 2.54; gap min 0.152, default 0.152
via viaSize (default): diameter min 0.5, default 0.61, max 10; hole min 0.3, default 0.305, max 6.3
net 12V uses copperThickness2oz

## Placement (name value [footprint] x y rotation side)
C9  100nF  [C0402_NEW]  28.83 49.66 0 top
C40  100nF  [C0402_NEW]  56.84 35.23 270 top
C105  1uF  [C0402]  63.66 35.79 0 top
C106  1uF  [C0402]  60.96 35.75 0 top
C108  100nF  [C0402_NEW]  13.49 26.86 90 top
C109  10uF  [C0402]  14.36 15.43 180 top
C110  15pF  [C0402]  16.13 26.92 90 top
C111  10uF  [C0402]  14.29 20.58 180 top
C112  10uF  [C0402]  9.46 20.2 180 top
C113  100nF  [C0402_NEW]  9.59 21.6 180 top
C114  100nF  [C0402_NEW]  14.29 21.98 180 top
C115  1uF  [C0402]  19.69 7.87 90 top
C116  1uF  [C0402]  19.69 10.92 90 top
D12  SS54  [SMA_L4.4-W2.8-LS5.4-R-RD]  34.8 17.91 270 top
D13  SS54  [SMA_L4.4-W2.8-LS5.4-R-RD]  44.07 17.78 270 top
D14  SS54  [SMA_L4.4-W2.8-LS5.4-R-RD]  53.59 18.03 270 top
D15  SS54  [SMA_L4.4-W2.8-LS5.4-R-RD]  25.4 17.53 270 top
DIO  TS-1071AS-A1B3-D4  [SW-SMD_L4.0-W3.0-LS4.8]  54.46 35.28 270 top
EN  TS-1071AS-A1B3-D4  [SW-SMD_L4.0-W3.0-LS4.8]  29.12 47.1 0 top
FPC1  -  [FPC-SMD_P0.50-24P_XJ-FGS]  14.46 30.98 0 top
LIGHT1  WJ500V-5.08-2P  [CONN-TH_2P-P5.00_WJ500V-5.08-2P]  27.56 5.72 180 top
LIGHT2  WJ500V-5.08-2P  [CONN-TH_2P-P5.00_WJ500V-5.08-2P]  38.99 5.72 180 top
LIGHT3  WJ500V-5.08-2P  [CONN-TH_2P-P5.00_WJ500V-5.08-2P]  50.45 5.67 180 top
LIGHT4  WJ500V-5.08-2P  [CONN-TH_2P-P5.00_WJ500V-5.08-2P]  61.72 5.72 180 top
OPT3001  HX-XH2.54-6PZZ  [CONN-TH_6P-P2.50_BX-XH2.54-6PZZ]  68.96 32.77 270 top
PIR  HX-XH2.54-3PZZ  [CONN-TH_3P-P2.50_HC-XH-3A-G]  69.09 47.24 270 top
POWER  WJ500V-5.08-2P  [CONN-TH_2P-P5.00_WJ500V-5.08-2P]  68.45 17.65 270 top
Q2  IRL540NPBF  [TO-220-3_L10.0-W4.5-P2.54-T]  29.75 20.02 0 top
Q3  IRL540NPBF  [TO-220-3_L10.0-W4.5-P2.54-T]  39.16 20.15 0 top
Q4  IRL540NPBF  [TO-220-3_L10.0-W4.5-P2.54-T]  48.8 20.06 0 top
Q5  IRL540NPBF  [TO-220-3_L10.0-W4.5-P2.54-T]  58.21 20.06 0 top
R5  10kΩ  [R0402]  58.17 35.49 90 top
R13  10kΩ  [R0402]  28.76 51.07 180 top
R92  1kΩ  [R0402]  14.86 27.05 90 top
R93  10kΩ  [R0402]  12.22 26.98 270 top
R94  10kΩ  [R0402]  9.53 27.05 270 top
R95  10kΩ  [R0402]  10.92 27.05 270 top
R96  5.1kΩ  [R0402]  61.43 48.07 0 top
R97  5.1kΩ  [R0402]  56.48 48.07 0 top
R98  10kΩ  [R0402]  25.91 22.67 90 top
R99  10kΩ  [R0402]  44.96 22.73 90 top
R100  10kΩ  [R0402]  54.49 22.93 90 top
R101  10kΩ  [R0402]  35.43 22.99 90 top
R102  330Ω  [R0402]  24.64 22.73 90 top
R103  330Ω  [R0402]  43.69 22.73 90 top
R104  330Ω  [R0402]  53.09 22.99 90 top
R105  330Ω  [R0402]  34.16 22.99 90 top
U2  ESP32-S3-WROOM-1-N16  [WIRELM-SMD_ESP32-S3-WROOM-1]  42.04 40.89 0 top
U31  BX-TYPE-C-C-MWT16P  [USB-C-SMD_BX-TYPE-C-C-MWT16P]  58.97 52.65 180 top
U33  XC6206-2.8V  [SOT-23-3_L2.9-W1.6-P1.90-LS2.8-BR]  9.34 17.28 90 top
U34  XC6206-1.2V  [SOT-23-3_L3.0-W1.6-P1.90-LS2.8-BR]  14.34 17.81 90 top
U35  AMS1117-3.3  [SOT-223-3_L6.5-W3.4-P2.30-LS7.0-BR]  62.14 41.52 270 top
U36  AMS1117-5.0  [SOT-223_L6.5-W3.5-P2.30-LS7.0-BR]  14.19 9 0 top

## Footprints (pads in the part's own frame, mm; a bottom-side part is the same pattern mirrored in y, then rotated)
C0402
  rect 0.79x0.54 smd: 1(-0.545,0) 2(0.545,0)
C0402_NEW
  rect 0.79x0.54 smd: 1(-0.545,0) 2(0.545,0)
CONN-TH_2P-P5.00_WJ500V-5.08-2P
  round 2 hole 1.3: 1(-2.54,0) 2(2.54,0)
CONN-TH_3P-P2.50_HC-XH-3A-G
  rect 1.524x1.524 hole 0.914: 1(-2.5,0)
  round 1.524 hole 0.914: 2(0,0) 3(2.5,0)
CONN-TH_6P-P2.50_BX-XH2.54-6PZZ
  rect 1.524x1.524 hole 0.914: 1(-6.25,0)
  round 1.524 hole 0.914: 2(-3.75,0) 3(-1.25,0) 4(1.25,0) 5(3.75,0) 6(6.25,0)
FPC-SMD_P0.50-24P_XJ-FGS
  rect 0.3x1.25 smd: 1(-5.752,-1.262) 2(-5.25,-1.262) 3(-4.75,-1.262) 4(-4.25,-1.262) 5(-3.75,-1.262) 6(-3.25,-1.262) 7(-2.75,-1.262) 8(-2.25,-1.262) 9(-1.75,-1.262) 10(-1.25,-1.262) 11(-0.75,-1.262) 12(-0.25,-1.262) 13(0.25,-1.262) 14(0.75,-1.262) 15(1.25,-1.262) 16(1.75,-1.262) 17(2.25,-1.262) 18(2.75,-1.262) 19(3.25,-1.262) 20(3.75,-1.262) 21(4.25,-1.262) 22(4.75,-1.262) 23(5.25,-1.262) 24(5.75,-1.262)
  rect 2.4x2 smd: 25(-7.65,1.262) 26(7.65,1.262)
R0402
  rect 0.566x0.54 smd: 1(-0.433,0) 2(0.433,0)
SMA_L4.4-W2.8-LS5.4-R-RD
  rect 2.062x1.539 smd: 1(2.503,0) 2(-2.503,0)
SOT-23-3_L2.9-W1.6-P1.90-LS2.8-BR
  rect 1.07x0.6 smd: 1(1.235,-0.95) 2(1.235,0.95) 3(-1.235,0)
SOT-23-3_L3.0-W1.6-P1.90-LS2.8-BR
  rect 1.07x0.532 smd: 1(1.135,-0.95) 2(1.135,0.95) 3(-1.135,0)
SOT-223-3_L6.5-W3.4-P2.30-LS7.0-BR
  rect 2.5x1.1 smd: 1(2.97,-2.3) 2(2.97,0) 3(2.97,2.3)
  rect 2.34x3.6 smd: 4(-2.97,0)
SOT-223_L6.5-W3.5-P2.30-LS7.0-BR
  rect 2.465x1.05 smd: 1(2.857,-2.3) 2(2.857,0) 3(2.857,2.3)
  rect 2.465x3.54 smd: 4(-2.857,0)
SW-SMD_L4.0-W3.0-LS4.8
  rect 1.35x1.8 smd: 1(-2.075,0) 2(2.075,0)
TO-220-3_L10.0-W4.5-P2.54-T
  rect 2.5x2 hole 1.3: 1(0,2.54)
  oval 2.5x2 hole 1.3: 2(0,0) 3(0,-2.54)
USB-C-SMD_BX-TYPE-C-C-MWT16P
  oval 1.2x2.5 hole 0.7x1.8: 1(-4.32,1.54) 3(4.32,1.54)
  oval 1.2x2 hole 0.7x1.5: 2(-4.32,-2.64) 4(4.32,-2.64)
  rect 0.6x1.524 smd: A1B12(-3.165,2.64) A4B9(-2.365,2.64) B1A12(3.165,2.64) B4A9(2.365,2.64)
  rect 0.3x1.524 smd: A5(-1.25,2.64) A6(-0.25,2.64) A7(0.25,2.64) A8(1.25,2.64) B5(1.75,2.64) B6(0.75,2.64) B7(-0.75,2.64) B8(-1.75,2.64)
WIRELM-SMD_ESP32-S3-WROOM-1
  rect 1.5x0.9 smd: 1(-8.75,8.895) 2(-8.75,7.625) 3(-8.75,6.355) 4(-8.75,5.085) 5(-8.75,3.815) 6(-8.75,2.545) 7(-8.75,1.275) 8(-8.75,0.005) 9(-8.75,-1.265) 10(-8.75,-2.535) 11(-8.75,-3.805) 12(-8.75,-5.075) 13(-8.75,-6.345) 14(-8.75,-7.615) 27(8.75,-7.615) 28(8.75,-6.345) 29(8.75,-5.075) 30(8.75,-3.805) 31(8.75,-2.535) 32(8.75,-1.265) 33(8.75,0.005) 34(8.75,1.275) 35(8.75,2.545) 36(8.75,3.815) 37(8.75,5.085) 38(8.75,6.355) 39(8.75,7.625) 40(8.75,8.895)
  rect 0.9x1.5 smd: 15(-6.985,-8.895) 16(-5.715,-8.895) 17(-4.445,-8.895) 18(-3.175,-8.895) 19(-1.905,-8.895) 20(-0.635,-8.895) 21(0.635,-8.895) 22(1.905,-8.895) 23(3.175,-8.895) 24(4.445,-8.895) 25(5.715,-8.895) 26(6.985,-8.865)
  rect 0.9x0.9 smd: 41(-2.9,2.575) 41(-2.9,1.175) 41(-2.9,-0.225) 41(-1.5,2.575) 41(-1.5,1.175) 41(-1.5,-0.225) 41(-0.1,2.575) 41(-0.1,1.175) 41(-0.1,-0.225)

## Nets
As in the schematic.

Pads without a net: FPC1 1 23 24; U2 15 16 25 26 35 38 39; U31 A8 B8

## Via types
v1: diameter 0.61, hole 0.305, Top Layer to Bottom Layer, 44 vias

## Routing (per net, layer and track width the routed paths; a pad name or vN(x,y) marks a point on that pad's centre or on a via; arc(x,y) is an arc through that point)
3V3: length 122.8
  Top Layer w0.3: C109.2 13.82,16.15 U34.3 12.87,18.15 12.82,18.15 ; R5.2 58.6,36.35 61.21,36.35 61.51,36.05 ; v1(34.37,48.52) U2.2 ; 62.14,40.05 62.74,40.65 67.33,40.65 OPT3001.1 ; 62.14,40.05 U35.4 64.54,46.89 v1(65.74,46.89) ; 62.14,40.05 U35.2 61.51,37.92 61.51,36.05 ; R93.2 12.22,19.35 12.82,18.75 12.82,18.15 ; 61.51,36.05 C106.2 ; U33.3 11.44,18.15 12.82,18.15 ; v1(28.33,50.47) R13.2 ; 12.21,26.55 v1(11.62,26.55) 10.99,26.55 R95.2 R94.2
  Bottom Layer w0.3: 28.48,50.32 v1(28.33,50.47) ; 28.48,50.32 11.32,33.15 11.32,28.35 11.62,28.05 v1(11.62,26.55) ; 28.48,50.32 28.97,50.32 30.77,48.52 v1(34.37,48.52) 36.34,50.49 53.14,50.49 54.94,48.69 60.64,48.69 61.54,49.59 63.04,49.59 v1(65.74,46.89) 66.23,46.89 PIR.1
12V: length 115.5
  Top Layer w0.54: U36.3 17.22,11.47 C116.2 19.69,12.08 26.02,18.41 ; 30.02,15.41 30.02,5.8 LIGHT1.1
  Top Layer w1: 49.34,15.28 49.34,9.32 LIGHT3.1 55.74,2.92 61.47,2.92 LIGHT4.1 64.26,16 POWER.1 ; 49.34,15.28 48.07,15.28 44.07,19.28 44.07,19.55 ; 49.34,15.28 53.59,19.54 D14.2 ; LIGHT2.1 39.8,7.45 39.8,15.28 ; D13.2 44.07,19.55 ; 44.07,19.55 39.8,15.28 ; D15.2 26.02,19.41 26.02,18.41 29.02,15.41 30.8,15.41 34.8,19.41 ; 39.8,15.28 38.8,15.28 34.8,19.28 34.8,19.41 ; 34.8,19.41 D12.2
+5V: length 103.7
  Top Layer w0.3: U36.2 15.57,7.52 15.48,7.52 ; 15.48,7.52 12.81,7.52 U36.4 ; 15.48,7.52 15.48,6.02 15.78,5.72 19.38,5.72 20.28,6.62 20.28,8.12 19.99,8.42 C115.2 19.74,8.47 v1(19.74,9.32) ; 56.61,50 56.61,50.9 57.51,51.8 60.44,51.8 61.34,50.9 U31.A4B9 61.34,49.12 v1(61.64,48.82) ; C105.2 64.21,37.29 64.44,37.52 64.44,38.42 ; 64.44,38.42 U35.3 ; 64.44,38.42 v1(63.24,39.62)
  Bottom Layer w0.3: 58.44,42.02 58.44,45.62 v1(61.64,48.82) ; 58.44,42.02 54.84,38.42 35.94,38.42 19.74,22.22 v1(19.74,9.32) ; 58.44,42.02 60.84,39.62 v1(63.24,39.62)
GND: length 291.1
  Top Layer w0.3: 52.54,21.9 52.24,22.2 51.94,22.2 51.79,22.35 51.79,23.25 54.49,25.95 ; 52.54,21.9 50.44,19.8 50.44,19.5 48.94,18 ; 52.54,21.9 53.89,21.9 54.49,22.5 ; 10.11,18.43 10.11,18.13 8.61,16.63 8.61,15.43 9.21,14.83 14.61,14.83 ; 10.11,18.43 10.21,18.43 U33.1 ; 10.11,18.43 10.11,20.23 ; 63.13,35.49 63.43,35.19 67.63,35.19 OPT3001.2 70.29,37.84 70.29,43.54 PIR.3 65.13,48.71 62.45,48.71 ; 63.13,35.49 62.53,35.49 61.93,34.89 61.33,34.89 ; 63.13,35.49 C105.1 ; 18.76,8.28 18.76,7.98 19.06,7.68 19.34,7.68 C115.1 ; 18.76,8.28 18.63,8.28 U36.1 ; 18.76,8.28 18.76,9.18 19.06,9.48 19.06,10.38 ; 54.49,25.95 54.49,26.55 61.33,33.39 61.33,34.89 ; 54.49,25.95 57.61,25.95 60.01,23.55 60.01,21.15 ; FPC1.2 9.21,30.43 8.91,30.73 8.31,30.73 8.01,30.43 8.01,27.13 10.11,25.03 10.11,21.43 ; 62.15,49.91 62.15,50.81 62.75,51.41 62.75,51.65 ; 62.15,49.91 U31.A1B12 ; 62.15,49.91 62.15,49.31 62.45,49.01 62.45,48.71 ; U2.41 U2.41 U2.41 ; 35.43,22.2 R101.1 ; 35.43,22.2 35.96,21.68 35.96,21.08 38.96,18.08 39.56,18.08 ; 35.43,22.2 35.13,21.9 33.93,21.9 30.03,18 ; 30.03,18 29.55,18 26.73,20.82 26.73,21.12 25.91,21.94 ; 30.03,18 29.75,17.72 Q2.3 ; 61.33,34.89 61.03,34.89 60.73,35.19 60.73,35.44 C106.1 ; R92.1 15.16,26.62 15.46,26.92 15.46,28.12 15.71,28.37 FPC1.15 15.71,30.77 18.08,33.14 19.28,33.14 20.18,32.24 FPC1.26 ; R92.1 14.56,26.32 ; R92.1 15.1,26.38 C110.1 20.87,21.64 25.61,21.64 25.91,21.94 ; 54.65,53.02 55.08,53.45 61.06,53.45 61.14,53.37 ; 54.65,53.02 U31.3 ; 54.65,53.02 U31.4 ; 60.01,21.15 60.01,19.32 Q5.3 ; 60.01,21.15 60.61,21.75 69.01,21.75 69.91,20.85 69.91,16.57 POWER.2 ; U2.41 U2.41 U2.41 U2.41 39.14,44.84 34.19,49.79 U2.1 31.32,51.76 27.98,51.76 27.68,51.46 27.68,50.26 C9.1 28.28,48.34 EN.1 ; U2.41 U2.41 U2.41 U2.41 48.26,49.79 U2.40 52.1,51.11 U31.3 ; Q3.3 39.16,17.68 39.56,18.08 ; 62.45,48.71 62.45,48.66 61.86,48.07 61.86,47.77 59.84,45.74 U35.1 59.6,38.55 C40.1 55.26,37.36 DIO.1 ; 62.75,51.65 U31.1 ; 62.75,51.65 62.75,51.71 62.61,51.84 62.61,52.45 61.69,53.37 61.14,53.37 ; 25.91,21.94 25.91,22.24 ; U31.3 54.71,51.11 U31.B1A12 55.81,48.3 R97.1 ; 39.56,18.08 43.16,21.68 44.36,21.68 44.96,22.28 ; 48.94,18 48.64,18 45.04,21.6 45.04,22.2 44.96,22.28 ; 48.94,18 48.94,17.65 Q4.3 ; 44.96,22.28 44.96,22.3 ; 19.06,10.38 15.77,10.38 14.61,11.53 14.61,14.83 ; 19.06,10.38 C116.1 ; 8.31,30.74 FPC1.25 ; 14.56,26.32 13.49,26.32 ; 14.56,26.32 14.56,22.26 C114.1 C111.1 14.84,19.4 U34.1 15.29,15.82 C109.1 14.61,15.13 14.61,14.83 ; 10.11,21.43 C113.1 ; 10.11,21.43 10.11,20.23 ; 61.14,53.37 61.14,54.4 62.02,55.28 U31.2 ; 10.11,20.23 C112.1
ADR: length 21.5
  Top Layer w0.3: v1(55.83,34.55) U2.28
  Bottom Layer w0.3: OPT3001.6 63.86,26.52 v1(55.83,34.55)
CSI_1.2V: length 11.1
  Top Layer w0.3: v1(13.21,28.51) FPC1.10 ; U34.2 13.75,19.29 C111.2 C114.2 13.75,24.98 v1(13.45,25.28)
  Bottom Layer w0.3: v1(13.45,25.28) 13.45,28.28 v1(13.21,28.51)
CSI_2.8V: length 15
  Top Layer w0.3: U33.2 8.92,19.05 C112.2 8.92,21.47 C113.2 v1(9.05,25.2) ; v1(10.25,31.2) 10.25,29.75 FPC1.4
  Bottom Layer w0.3: v1(10.25,31.2) 9.05,30 v1(9.05,25.2)
CSI_D0: length 25.8
  Top Layer w0.3: U2.19 40.09,31.96 40.09,31.4 38.59,29.9 38.29,29.9 37.39,30.8 20.82,30.8 19.81,31.81 18.91,31.81 17.71,30.61 FPC1.19
CSI_D1: length 32.4
  Top Layer w0.3: U2.24 46.18,32.3 v1(46.18,33.2) ; v1(36.11,30.01) 34.61,28.51 19.01,28.51 18.71,28.81 FPC1.21
  Bottom Layer w0.3: v1(36.11,30.01) 40.04,33.95 45.43,33.95 v1(46.18,33.2)
CSI_D2: length 34.6
  Top Layer w0.3: FPC1.22 v1(19.21,30.91) ; v1(21.61,25.21) 39.01,25.21 45.21,31.42 U2.23
  Bottom Layer w0.3: v1(21.61,25.21) 19.21,27.61 v1(19.21,30.91)
CSI_D3: length 24.2
  Top Layer w0.3: U2.18 38.45,31.58 v1(38.45,30.91) ; v1(37.11,30.01) 35.01,27.91 18.81,27.91 18.21,28.51 FPC1.20
  Bottom Layer w0.3: v1(37.11,30.01) 37.55,30.01 v1(38.45,30.91)
CSI_D4: length 28.2
  Top Layer w0.3: FPC1.18 17.21,28.81 18.71,27.31 37.61,27.31 41.4,31.11 U2.20
CSI_D5: length 20.7
  Top Layer w0.3: U2.11 23.28,37.09 v1(19.81,33.61) ; v1(18.61,32.41) 18.01,32.41 16.21,30.61 FPC1.16
  Bottom Layer w0.3: v1(18.61,32.41) v1(19.81,33.61)
CSI_D6: length 22.4
  Top Layer w0.3: U2.10 22.65,38.36 15.21,30.91 FPC1.14
CSI_D7: length 24.3
  Top Layer w0.3: v1(13.91,30.91) 14.21,30.61 FPC1.12 ; U2.9 33.27,39.61 v1(23.51,39.61)
  Bottom Layer w0.3: v1(13.91,30.91) 14.81,30.91 v1(23.51,39.61)
CSI_HSYNC: length 26.3
  Top Layer w0.3: FPC1.9 12.71,30.61 24.11,42.01 33.13,42.01 U2.7
CSI_MCLK: length 24.4
  Top Layer w0.3: FPC1.13 14.71,31.81 23.71,40.81 33.2,40.81 U2.8
CSI_PCLK: length 31.7
  Top Layer w0.3: FPC1.17 16.73,29.69 16.73,28.07 ; 16.73,28.07 17.03,28.07 18.53,26.57 37.84,26.57 42.64,31.37 42.64,31.97 U2.21 ; 16.73,28.07 C110.2
CSI_RST: length 39.8
  Top Layer w0.3: U2.22 43.94,31.49 38.39,25.94 18.29,25.94 v1(17.09,27.14) ; 13.75,27.14 C108.2 12.32,27.4 ; 13.75,27.14 13.77,27.12 13.78,27.12 13.79,27.12 13.79,27.13 13.78,27.14 13.75,27.14 ; 13.75,27.14 12.59,27.14 12.32,27.4 ; 12.32,27.4 12.23,27.4 R93.1 ; 12.32,27.4 11.21,28.51 FPC1.6 ; 13.79,27.14 v1(14.09,27.44)
  Bottom Layer w0.3: v1(14.09,27.44) 16.79,27.44 v1(17.09,27.14)
CSI_VSYNC: length 27.8
  Top Layer w0.3: U2.6 24.53,43.44 11.71,30.61 FPC1.7
D+: length 36.9
  Top Layer w0.3: 58.19,48.88 59.09,48.88 59.22,49.01 U31.A6 ; 58.19,48.88 58.19,49.97 U31.B6 ; 58.19,48.88 58.19,48.28 57.29,47.38 55.19,47.38 v1(52.79,49.78) ; v1(49.49,46.78) 35.99,33.28 U2.14
  Bottom Layer w0.3: v1(52.79,49.78) 52.49,49.78 v1(49.49,46.78)
D-: length 38.3
  Top Layer w0.3: 59.69,50.15 59.69,48.65 57.89,46.85 53.69,46.85 v1(52.19,48.35) ; 59.69,50.15 59.69,51.05 59.39,51.35 59.09,51.35 58.72,50.98 U31.A7 ; 59.69,50.15 U31.B7 ; v1(41.39,39.65) 36.29,34.55 U2.13
  Bottom Layer w0.3: v1(41.39,39.65) 43.49,39.65 v1(52.19,48.35)
DIO: length 8.2
  Top Layer w0.3: R5.1 57.81,34.69 C40.2 55.35,33.21 DIO.2 50.86,33.21 U2.27
EN: length 6.9
  Top Layer w0.3: 31.17,47.26 31.17,47.86 C9.2 29.37,50.89 R13.1 ; 31.17,47.26 33.28,47.26 U2.3 ; 31.17,47.26 31.17,47.12 EN.2
INT: length 21
  Top Layer w0.3: v1(55.86,35.82) U2.29
  Bottom Layer w0.3: OPT3001.5 62.66,29.02 v1(55.86,35.82)
LIGHT1: length 35.8
  Top Layer w0.3: U2.33 44.49,40.9 v1(36.99,33.4) ; v1(27.99,24.4) 24.69,24.4 24.04,23.75 24.04,22.55 24.29,22.3 24.64,22.3
  Bottom Layer w0.3: v1(36.99,33.4) v1(27.99,24.4)
LIGHT2: length 25.4
  Top Layer w0.3: R105.1 34.01,22.55 33.56,23.01 33.56,23.91 33.99,24.33 v1(34.89,24.33) ; v1(43.89,33.33) 50.19,39.63 U2.32
  Bottom Layer w0.3: v1(43.89,33.33) v1(34.89,24.33)
LIGHT3: length 19.9
  Top Layer w0.3: v1(45.09,33.26) 50.19,38.36 U2.31 ; v1(43.69,28.86) 43.09,28.26 43.09,22.73 43.52,22.3 43.69,22.3
  Bottom Layer w0.3: v1(43.69,28.86) 45.09,30.26 v1(45.09,33.26)
LIGHT4: length 16.1
  Top Layer w0.3: R104.1 52.85,22.79 v1(52.49,22.79) ; v1(51.99,36.49) 51.39,37.09 U2.30
  Bottom Layer w0.3: v1(51.99,36.49) 51.99,23.29 v1(52.49,22.79)
PIR_OUT: length 20.4
  Top Layer w0.3: v1(59.21,42.17) U2.34
  Bottom Layer w0.3: PIR.2 64.01,42.17 v1(59.21,42.17)
SCL: length 35.3
  Top Layer w0.3: U2.17 37.76,32.17 37.76,32.77 39.61,34.62 v1(43.46,34.62)
  Bottom Layer w0.3: OPT3001.3 58.76,34.02 55.46,37.32 46.16,37.32 v1(43.46,34.62)
SDA: length 42.6
  Top Layer w0.3: v1(34.56,36.12) 33.59,36.12 U2.12
  Bottom Layer w0.3: v1(34.56,36.12) 36.26,37.82 61.76,37.82 64.16,35.42 69.26,35.42 70.16,34.52 70.16,32.72 OPT3001.4
TWI_SCL: length 31.6
  Top Layer w0.3: 33.28,44.71 24.81,44.71 10.71,30.61 FPC1.5 10.71,27.7 R95.1
TWI_SDA: length 34.1
  Top Layer w0.3: U2.4 32.92,45.61 23.51,45.61 9.41,31.51 9.41,31.21 9.71,30.91 FPC1.3 9.71,27.67 R94.1
$2N5410: length 2.3
  Top Layer w0.3: R96.1 60.22,48.84 U31.A5
$2N5414: length 2.1
  Top Layer w0.3: R97.2 57.22,48.38 U31.B5
$3N380: length 25.7
  Top Layer w0.3: LIGHT1.2 25.02,14.64 D15.1
  Bottom Layer w0.3: Q2.2 25.02,15.29 LIGHT1.2
$3N383: length 5.4
  Top Layer w0.3: R102.2 24.7,23.11 R98.2 29.2,23.11 Q2.1
$3N715: length 5.3
  Top Layer w0.3: R105.2 R101.2 38.42,23.42 Q3.1
$3N716: length 16.9
  Top Layer w0.3: v1(36,16.6) D12.1 34.8,7.37 LIGHT2.2
  Bottom Layer w0.3: Q3.2 36,16.99 v1(36,16.6)
$3N1364: length 5.3
  Top Layer w0.3: Q4.1 48.23,23.17 R99.2 R103.2
$3N1375: length 17.9
  Top Layer w0.3: LIGHT3.2 44.07,9.51 D13.1 v1(45.27,16.48)
  Bottom Layer w0.3: Q4.2 45.27,16.52 v1(45.27,16.48)
$3N1376: length 5.5
  Top Layer w0.3: Q5.1 57.44,23.36 R100.2 53.14,23.36 R104.2
$3N1377: length 18.6
  Top Layer w0.3: LIGHT4.2 53.59,11.3 D14.1 53.68,15.53 Q5.2
$4N651: length 5.3
  Top Layer w0.3: FPC1.8 v1(12.21,28.51) ; v1(14.31,28.51) 14.86,27.96 R92.2
  Bottom Layer w0.3: v1(12.21,28.51) 13.11,29.41 13.41,29.41 v1(14.31,28.51)

## Copper pours and planes (outline as drawn; the poured copper is in the pictures)
GND on Top Layer: -2.03,61.85 77.22,61.85 77.22,-3.94 -2.03,-3.94
GND on Bottom Layer: -2.29,61.6 78.87,61.6 78.87,-3.56 -2.29,-3.56

## Text on the board
Top Silkscreen Layer: GND | 12V | INT | 3.3V | SDA | ADR | SCL | PIR | L1 | L2 | L3 | L4
